# Altium schematic sheet M169+ EX.SchDoc
size A4
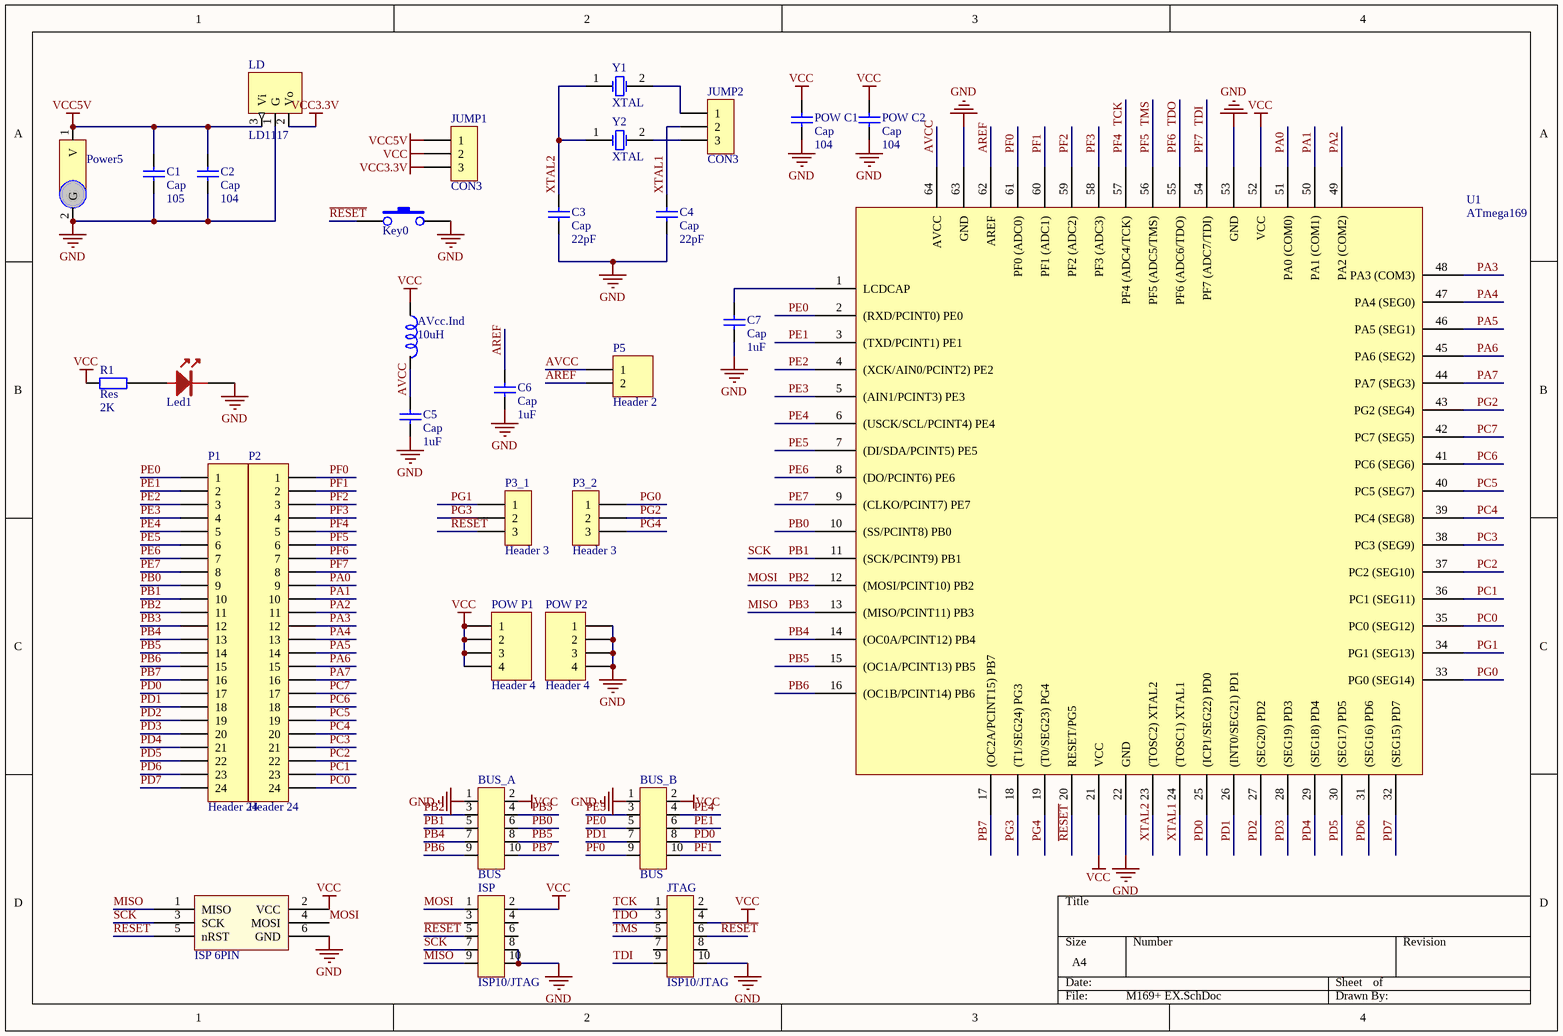
[diagram p0: M169+ EX.SchDoc]

## Parts
AVcc.Ind  10uH  [RES]
BUS_A  BUS  [ISP_10]
BUS_B  BUS  [ISP_10]
C1  Cap  value 105  [0805]
C2  Cap  value 104  [0805]
C3  Cap  value 22pF  [0603]
C4  Cap  value 22pF  [0603]
C5  Cap  value 1uF  [0805]
C6  Cap  value 1uF  [0805]
C7  Cap  value 1uF  [0805]
ISP  ISP10/JTAG  [ISP_10]
ISP_6PIN  ISP 6PIN  [ISP_6]  (value not drawn)
JTAG  ISP10/JTAG  [ISP_10]
JUMP1  CON3  [SIP3]
JUMP2  CON3  [SIP3]
Key0  PB2  [KEY]  (value not drawn)
LD  LD1117  [LD1117-3.3]
Led1  Led1  [0805_LED]  (value not drawn)
P1  Header 24  [SIP24]
P2  Header 24  [SIP24]
P3_1  Header 3  [SIP3]
P3_2  Header 3  [SIP3]
P5  Header 2  [SIP2]
POW_C1  Cap  value 104  [0805]
POW_C2  Cap  value 104  [0805]
POW_P1  Header 4  [SIP4]
POW_P2  Header 4  [SIP4]
Power5  5V  [PWR_5V]  (value not drawn)
R1  Res  value 2K  [0603]
U1  ATmega169  [TQFP64]
Y1  XTAL  [CRYSTAL]
Y2  XTAL  [CRYSTAL2]

## Nets
GND: BUS_A.1 BUS_B.1 C1.1 C2.1 C3.1 C4.1 C5.1 C6.1 C7.1 ISP.8 ISP.10 ISP_6PIN.6(GND) JTAG.10 Key0.2 LD.1(G) Led1.2 POW_C1.1 POW_C2.1 POW_P2.1 POW_P2.2 POW_P2.3 POW_P2.4 Power5.2(G) U1.22(GND) U1.53(GND) U1.63(GND)
VCC: AVcc.Ind.1 BUS_A.2 BUS_B.2 ISP.2 ISP_6PIN.2(VCC) JTAG.4 JUMP1.2 POW_C1.2 POW_C2.2 POW_P1.1 POW_P1.2 POW_P1.3 POW_P1.4 R1.2 U1.21(VCC) U1.52(VCC)
VCC3.3V: JUMP1.3 LD.2(Vo)
VCC5V: C1.2 C2.2 JUMP1.1 LD.3(Vi) Power5.1(V)
AREF: C6.2 P5.2 U1.62(AREF)
AVCC: AVcc.Ind.2 C5.2 P5.1 U1.64(AVCC)
MISO: BUS_A.4 ISP.9 ISP_6PIN.1(MISO) P1.12 U1.13((MISO/PCINT11)_PB3)  [also labelled PB3]
MOSI: BUS_A.3 ISP.1 ISP_6PIN.4(MOSI) P1.11 U1.12((MOSI/PCINT10)_PB2)  [also labelled PB2]
PA0: P2.9 U1.51(PA0_(COM0))
PA1: P2.10 U1.50(PA1_(COM1))
PA2: P2.11 U1.49(PA2_(COM2))
PA3: P2.12 U1.48(PA3_(COM3))
PA4: P2.13 U1.47(PA4_(SEG0))
PA5: P2.14 U1.46(PA5_(SEG1))
PA6: P2.15 U1.45(PA6_(SEG2))
PA7: P2.16 U1.44(PA7_(SEG3))
PB0: BUS_A.6 P1.9 U1.10((SS/PCINT8)_PB0)
PB1: BUS_A.5 ISP.7 ISP_6PIN.3(SCK) P1.10 U1.11((SCK/PCINT9)_PB1)  [also labelled SCK]
PB4: BUS_A.7 P1.13 U1.14((OC0A/PCINT12)_PB4)
PB5: BUS_A.8 P1.14 U1.15((OC1A/PCINT13)_PB5)
PB6: BUS_A.9 P1.15 U1.16((OC1B/PCINT14)_PB6)
PB7: BUS_A.10 P1.16 U1.17((OC2A/PCINT15)_PB7)
PC0: P2.24 U1.35(PC0_(SEG12))
PC1: P2.23 U1.36(PC1_(SEG11))
PC2: P2.22 U1.37(PC2_(SEG10))
PC3: P2.21 U1.38(PC3_(SEG9))
PC4: P2.20 U1.39(PC4_(SEG8))
PC5: P2.19 U1.40(PC5_(SEG7))
PC6: P2.18 U1.41(PC6_(SEG6))
PC7: P2.17 U1.42(PC7_(SEG5))
PD0: BUS_B.8 P1.17 U1.25((ICP1/SEG22)_PD0)
PD1: BUS_B.7 P1.18 U1.26((INT0/SEG21)_PD1)
PD2: P1.19 U1.27((SEG20)_PD2)
PD3: P1.20 U1.28((SEG19)_PD3)
PD4: P1.21 U1.29((SEG18)_PD4)
PD5: P1.22 U1.30((SEG17)_PD5)
PD6: P1.23 U1.31((SEG16)_PD6)
PD7: P1.24 U1.32((SEG15)_PD7)
PE0: BUS_B.5 P1.1 U1.2((RXD/PCINT0)_PE0)
PE1: BUS_B.6 P1.2 U1.3((TXD/PCINT1)_PE1)
PE2: P1.3 U1.4((XCK/AIN0/PCINT2)_PE2)
PE3: P1.4 U1.5((AIN1/PCINT3)_PE3)
PE4: BUS_B.4 P1.5 U1.6((USCK/SCL/PCINT4)_PE4)
PE5: BUS_B.3 P1.6 U1.7((DI/SDA/PCINT5)_PE5)
PE6: P1.7 U1.8((DO/PCINT6)_PE6)
PE7: P1.8 U1.9((CLKO/PCINT7)_PE7)
PF0: BUS_B.9 P2.1 U1.61(PF0_(ADC0))
PF1: BUS_B.10 P2.2 U1.60(PF1_(ADC1))
PF2: P2.3 U1.59(PF2_(ADC2))
PF3: P2.4 U1.58(PF3_(ADC3))
PF4: JTAG.1 P2.5 U1.57(PF4_(ADC4/TCK))  [also labelled TCK]
PF5: JTAG.5 P2.6 U1.56(PF5_(ADC5/TMS))  [also labelled TMS]
PF6: JTAG.3 P2.7 U1.55(PF6_(ADC6/TDO))  [also labelled TDO]
PF7: JTAG.9 P2.8 U1.54(PF7_(ADC7/TDI))  [also labelled TDI]
PG0: P3_2.1 U1.33(PG0_(SEG14))
PG1: P3_1.1 U1.34(PG1_(SEG13))
PG2: P3_2.2 U1.43(PG2_(SEG4))
PG3: P3_1.2 U1.18((T1/SEG24)_PG3)
PG4: P3_2.3 U1.19((T0/SEG23)_PG4)
~{RESET}: ISP.5 ISP_6PIN.5(nRST) JTAG.6 Key0.1 P3_1.3 U1.20(RESET/PG5)
XTAL1: C4.2 JUMP2.2 U1.24((TOSC1)_XTAL1)
XTAL2: C3.2 U1.23((TOSC2)_XTAL2) Y1.1(OSC1) Y2.1(OSC1)
NetC7_2: C7.2 U1.1(LCDCAP)
NetJUMP2_1: JUMP2.1 Y1.2(OSC2)
NetJUMP2_3: JUMP2.3 Y2.2(OSC2)
NetLed1_1: Led1.1 R1.1

Not connected (* = marked no-connect by the designer): ISP 3 4 6; JTAG 2 7 8

## Library data of the parts
AVcc.Ind = IND
BUS_A BUS_B ISP JTAG = ISP_10
C1-C7 POW_C1 POW_C2 = Cap: Capacitor; Published: 8-Jun-2000; LatestRevisionDate: 17-Jul-2002; LatestRevisionNote: Re-released for DXP Platform.; PackageReference: RAD-0.3; Publisher: Altium Limited
JUMP1 JUMP2 = CON3: Connector
Key0 = KEY
Led1 = LED
P1 P2 = Header 24: Header, 24-Pin; LatestRevisionDate: 17-Jul-2002; LatestRevisionNote: Re-released for DXP Platform.; Publisher: Altium Limited
P3_1 P3_2 = Header 3: Header, 3-Pin
P5 = Header 2: Header, 2-Pin; LatestRevisionDate: 17-Jul-2002; LatestRevisionNote: Re-released for DXP Platform.; Publisher: Altium Limited
POW_P1 POW_P2 = Header 4: Header, 4-Pin; LatestRevisionDate: 17-Jul-2002; LatestRevisionNote: Re-released for DXP Platform.; Publisher: Altium Limited
Power5 = Power5
R1 = Res2: Resistor; Published: 8-Jun-2000; LatestRevisionDate: 17-Jul-2002; LatestRevisionNote: Re-released for DXP Platform.; PackageReference: AXIAL-0.4; Publisher: Altium Limited
Y1 Y2 = XTAL: Crystal Oscillator; Published: 8-Jun-2000; LatestRevisionDate: 17-Jul-2002; LatestRevisionNote: Re-released for DXP Platform.; PackageReference: R38; Publisher: Altium Limited